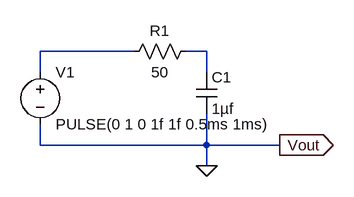
[diagram p0: schematic Draft1.asc]
Draft1.asc, the LTspice schematic file:
Version 4
SHEET 1 1064 704
WIRE 768 512 624 512
WIRE 880 512 848 512
WIRE 624 544 624 512
WIRE 880 544 880 512
WIRE 624 656 624 624
WIRE 880 656 880 608
WIRE 880 656 624 656
WIRE 992 656 880 656
WIRE 880 688 880 656
FLAG 880 688 0
FLAG 992 656 Vout
IOPIN 992 656 Out
SYMBOL voltage 624 528 R0
SYMATTR InstName V1
SYMATTR Value PULSE(0 1 0 1f 1f 0.5ms 1ms)
SYMBOL res 752 528 R270
WINDOW 0 32 56 VTop 2
WINDOW 3 0 56 VBottom 2
SYMATTR InstName R1
SYMATTR Value 50
SYMBOL cap 864 544 R0
SYMATTR InstName C1
SYMATTR Value 1µf

The netlist it stands for:
* Draft1.asc
V1 N001 0 PULSE(0 1 0 1f 1f 0.5ms 1ms)
R1 N001 N002 50
C1 N002 0 1µf
.backanno
.end